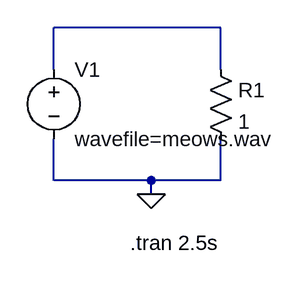
[diagram p0: schematic simWave.asc]
simWave.asc, the LTspice schematic file:
Version 4
SHEET 1 880 680
WIRE 320 208 128 208
WIRE 128 256 128 208
WIRE 320 256 320 208
WIRE 128 384 128 336
WIRE 240 384 128 384
WIRE 320 384 320 336
WIRE 320 384 240 384
WIRE 240 400 240 384
FLAG 240 400 0
SYMBOL voltage 128 240 R0
SYMATTR InstName V1
SYMATTR Value wavefile=meows.wav
SYMBOL res 304 240 R0
SYMATTR InstName R1
SYMATTR Value 1
TEXT 216 456 Left 2 !.tran 2.5s

The netlist it stands for:
* simWave.asc
V1 N001 0 wavefile=meows.wav
R1 N001 0 1
.tran 2.5s
.backanno
.end